# EAGLE schematic main (EAGLE 9.6.2)
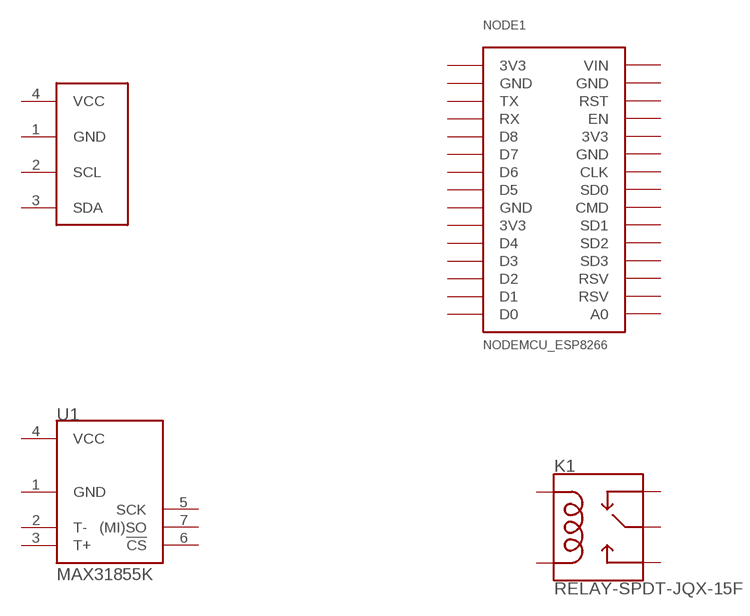
[diagram p0: schematic, sheet 1]

## Parts
K1  RELAY-SPDT-JQX-15F  [RELAY-T90]
NODE1  NODEMCU_ESP8266  [NODEMCU_ESP8266]
U1  MAX31855K  [SO08]
U$1  I2C_OLED  [I2C_OLED_PACKAGE]
Unconnected: K1.COIL1 K1.COIL2 K1.MAIN K1.NC K1.NO NODE1.A0 NODE1.CLK NODE1.CMD NODE1.D0 NODE1.D1 NODE1.D2 NODE1.D3 NODE1.D4 NODE1.D5 NODE1.D6 NODE1.D7 NODE1.D8 NODE1.EN NODE1.RST NODE1.RSV1(RSV) NODE1.RSV2(RSV) NODE1.RX NODE1.SD1 NODE1.SD2 NODE1.SD3 NODE1.SDO(SD0) NODE1.TX U1.1(GND) U1.2(T-) U1.3(T+) U1.4(VCC) U1.5(SCK) U1.6(!CS) U1.7((MI)SO) U$1.1(GND) U$1.2(SCL) U$1.3(SDA) U$1.4(VCC)

## Power pins joined to a net without a drawn wire
3V3: NODE1.3V3@1(3V3) NODE1.3V3@2(3V3) NODE1.3V3@3(3V3)
GND: NODE1.GND@1(GND) NODE1.GND@2(GND) NODE1.GND@3(GND) NODE1.GND@4(GND)
VIN: NODE1.VIN

## Library data of the parts
K1 = SparkFun-Electromechanical:RELAY-SPDT: SPDT Electromechanical Relay Single-pole, double-throw sealed relays. When current is applied to the coil, it throws a simple changeover switch, terminating the connection from the NC contact to ground and closing the NO contact. Use them to switch high voltage/high current devices. SparkFun Products JQX-15F: Relay SPDT Sealed - 20A <https://www.sparkfun.com/products/10924> (COM-10924) JZC-11F: Relay SPDT Sealed <https://www.sparkfun.com/products/100> (COM-00100); PROD_ID: COMP-10736; SF_SKU: COM-10924
NODE1 = nodemcu_esp8266:NODEMCU_ESP8266: Node MCU V2 (ESP8266) Created by Harish
U1 = SparkFun-IC-Conversion:MAX31855K: Cold-Junction-Compensated K-Thermocoupleto-Digital Converter (-270°C to +1800°C) The MAX31855K performs cold-junction compensation and digitizes the signal from a type-K thermocouple. The data is output in a 14-bit resolution, SPI™-compatible, read-only format. This converter resolves temperatures to 0.25°C, allows readings as high as +1800°C and as low as -270°C, and exhibits thermocouple accuracy of ±2°C for temperatures ranging from -200°C to +700°C for K-type thermocouples. Datasheet <https://cdn.sparkfun.com/datasheets/Sensors/Temp/MAX31855K.pdf> SparkFun Products SparkFun Thermocouple Breakout - MAX31855K <https://www.sparkfun.com/products/13266> (SEN-13266); PROD_ID: IC-12578
U$1 = DIYMall_OLED:I2C_OLED